# Altium schematic sheet Main_Sheet.SchDoc
size A4; SheetNumber: 1; SheetTotal: 2
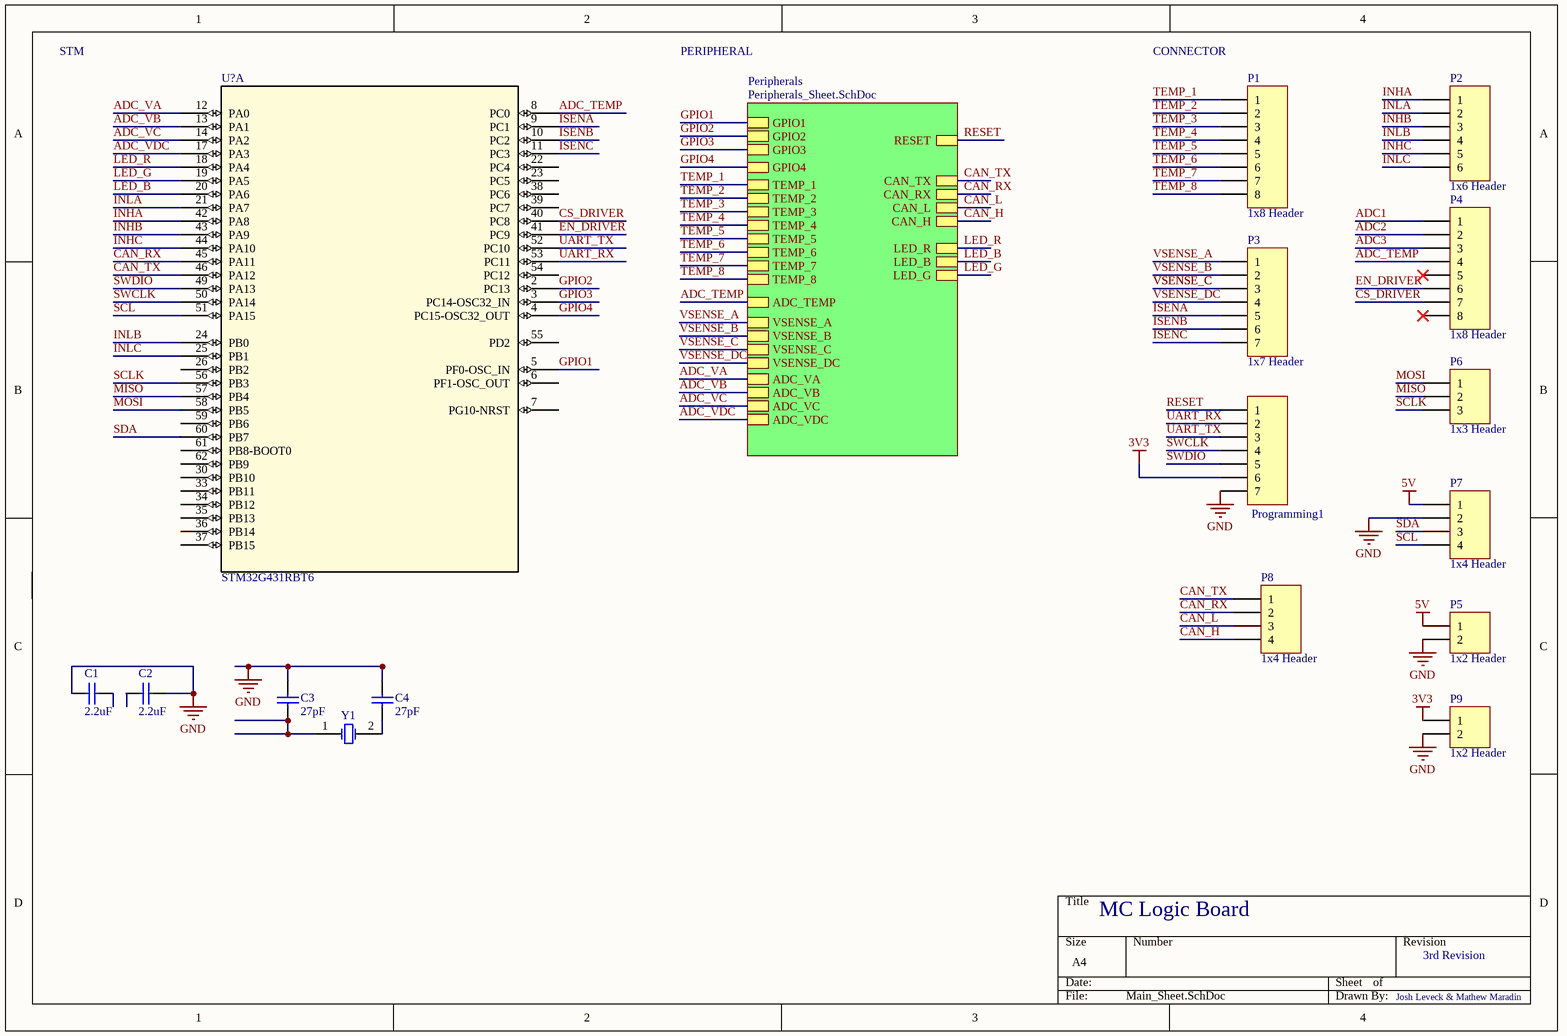
[diagram p0: Main_Sheet.SchDoc]

## Parts
C1  value 2.2uF  [0805 - Capacitor]  (hidden comment: Capacitor - Nonpolarized)
C2  value 2.2uF  [0805 - Capacitor]  (hidden comment: Capacitor - Nonpolarized)
C3  value 27pF  [0805 - Capacitor]  (hidden comment: 100V)
C4  value 27pF  [0805 - Capacitor]  (hidden comment: 100V)
P1  1x8 Header  [HDR1X8]
P2  1x6 Header  [HDR1X6]
P3  1x7 Header  [HDR1X7]
P4  1x8 Header  [HDR1X8]
P5  1x2 Header  [HDR1X2]
P6  1x3 Header  [HDR1X3]
P7  1x4 Header  [HDR1X4]
P8  1x4 Header  [HDR1X4]
P9  1x2 Header  [HDR1X2]
Programming1  Programming  [HDR1X7]  (value not drawn)
U?  STM32G431RBT6  [LQFP64-10x10mm]  (part A of 2)
Y1  Oscillator  [2-SMD NO LEAD CRSYSTAL]  (value not drawn)

## Sub-sheets
Peripherals = Peripherals_Sheet.SchDoc: GPIO1, GPIO2, GPIO3, TEMP_1, TEMP_2, TEMP_3, TEMP_4, TEMP_5, TEMP_6, TEMP_7, TEMP_8, ADC_TEMP, VSENSE_A, VSENSE_B, VSENSE_C, VSENSE_DC, ADC_VA, ADC_VB, ADC_VC, ADC_VDC, CAN_TX, CAN_RX, CAN_H, CAN_L, RESET, GPIO4, LED_R, LED_G, LED_B

## Nets
3V3: P9.1 Programming1.6
5V: P5.1 P7.1
GND: C1.1 C2.2 C3.2 C4.2 P5.2 P7.2 P9.2 Programming1.7
ADC1: P4.1
ADC2: P4.2
ADC3: P4.3
ADC_TEMP: P4.4 U?.8(PC0) ; sheet Peripherals/ADC_TEMP
ADC_VA: U?.12(PA0) ; sheet Peripherals/ADC_VA
ADC_VB: U?.13(PA1) ; sheet Peripherals/ADC_VB
ADC_VC: U?.14(PA2) ; sheet Peripherals/ADC_VC
ADC_VDC: U?.17(PA3) ; sheet Peripherals/ADC_VDC
CAN_H: P8.4 ; sheet Peripherals/CAN_H
CAN_L: P8.3 ; sheet Peripherals/CAN_L
CAN_RX: P8.2 U?.45(PA11) ; sheet Peripherals/CAN_RX
CAN_TX: P8.1 U?.46(PA12) ; sheet Peripherals/CAN_TX
CS_DRIVER: P4.7 U?.40(PC8)
EN_DRIVER: P4.6 U?.41(PC9)
GPIO1: U?.5(PF0-OSC_IN) ; sheet Peripherals/GPIO1
GPIO2: U?.2(PC13) ; sheet Peripherals/GPIO2
GPIO3: U?.3(PC14-OSC32_IN) ; sheet Peripherals/GPIO3
GPIO4: U?.4(PC15-OSC32_OUT) ; sheet Peripherals/GPIO4
INHA: P2.1 U?.42(PA8)
INHB: P2.3 U?.43(PA9)
INHC: P2.5 U?.44(PA10)
INLA: P2.2 U?.21(PA7)
INLB: P2.4 U?.24(PB0)
INLC: P2.6 U?.25(PB1)
ISENA: P3.5 U?.9(PC1)
ISENB: P3.6 U?.10(PC2)
ISENC: P3.7 U?.11(PC3)
LED_B: U?.20(PA6) ; sheet Peripherals/LED_B
LED_G: U?.19(PA5) ; sheet Peripherals/LED_G
LED_R: U?.18(PA4) ; sheet Peripherals/LED_R
MISO: P6.2 U?.57(PB4)
MOSI: P6.1 U?.58(PB5)
RESET: Programming1.1 ; sheet Peripherals/RESET
SCL: P7.4 U?.51(PA15)
SCLK: P6.3 U?.56(PB3)
SDA: P7.3 U?.60(PB7)
SWCLK: Programming1.4 U?.50(PA14)
SWDIO: Programming1.5 U?.49(PA13)
TEMP_1: P1.1 ; sheet Peripherals/TEMP_1
TEMP_2: P1.2 ; sheet Peripherals/TEMP_2
TEMP_3: P1.3 ; sheet Peripherals/TEMP_3
TEMP_4: P1.4 ; sheet Peripherals/TEMP_4
TEMP_5: P1.5 ; sheet Peripherals/TEMP_5
TEMP_6: P1.6 ; sheet Peripherals/TEMP_6
TEMP_7: P1.7 ; sheet Peripherals/TEMP_7
TEMP_8: P1.8 ; sheet Peripherals/TEMP_8
UART_RX: Programming1.2 U?.53(PC11)
UART_TX: Programming1.3 U?.52(PC10)
VSENSE_A: P3.1 ; sheet Peripherals/VSENSE_A
VSENSE_B: P3.2 ; sheet Peripherals/VSENSE_B
VSENSE_C: P3.3 ; sheet Peripherals/VSENSE_C
VSENSE_DC: P3.4 ; sheet Peripherals/VSENSE_DC
NetC3_1: C3.1 Y1.1(OSC1)
NetC4_1: C4.1 Y1.2(OSC2)

Not connected (* = marked no-connect by the designer): C1 2; C2 1; P4 5* 8*; U? 6(PF1-OSC_OUT) 7(PG10-NRST) 22(PC4) 23(PC5) 26(PB2) 30(PB10) 33(PB11) 34(PB12) 35(PB13) 36(PB14) 37(PB15) 38(PC6) 39(PC7) 54(PC12) 55(PD2) 59(PB6) 61(PB8-BOOT0) 62(PB9)

## Notes on the sheet
- STM
- PERIPHERAL
- CONNECTOR
- MC Logic Board
- 3rd Revision
- Josh Leveck & Mathew Maradin

## Library data of the parts
C1-C4 = Capacitor - Nonpolarized: Nonpolarized Capacitor; Supplier: *; Manufacturer: *; Rating: *; Manufacturer Part Number: *
  C1 C2: Supplier Part Number: 311-3420-1-ND
  C3 C4: Supplier Part Number: 311-1104-1-ND
P1 P4 = 1x8 Header: 1x8 Pin Header
P2 = 1x6 Header: 1x6 Pin Header
P3 Programming1 = 1x7 Header: 1x7 Pin Header
P5 P9 = 1x2 Header: 1x2 Pin Header
P6 = 1x3 Header: 1x3 Pin Header
P7 P8 = 1x4 Header: 1x4 Pin Header
U? = STM32G431RBT6: No Description Available; Mfr_Name: STMicroelectronics; Copyright: Copyright (C) 2022 Ultra Librarian. All rights reserved.; Manufacturer_Part_Number: STM32G431RBT6; RefDes: RefDes; Type: DEV
Y1 = Oscillator: Crystal Oscillator; Value: 16MHz; Manufacturer Part Number: *; Manufacturer: *; Supplier Part Number: 535-13460-1-ND; Supplier: *; Rating: *